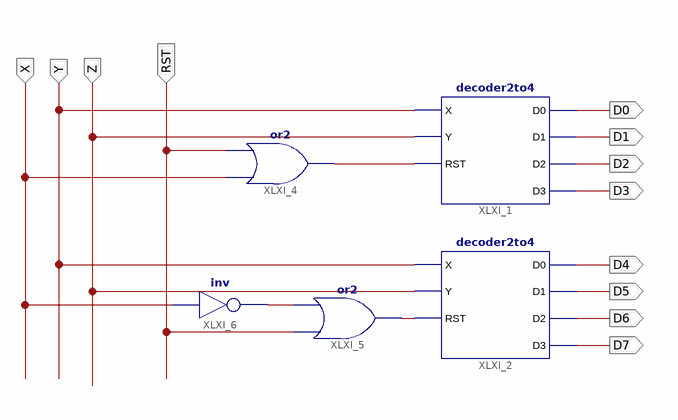
[diagram p0: schematic sheet 1]
// Xilinx ISE schematic decoder3to8.sch (artix7) as structural Verilog: 5 symbols, 12 ports
module decoder3to8 (
  input  Y,
  input  Z,
  input  X,
  input  RST,
  output D0,
  output D1,
  output D2,
  output D3,
  output D4,
  output D5,
  output D6,
  output D7
);

  wire XLXN_13, XLXN_14, XLXN_15;

  decoder2to4 XLXI_1 (.D0(D0), .D1(D1), .D2(D2), .D3(D3), .RST(XLXN_13), .X(Y), .Y(Z));
  decoder2to4 XLXI_2 (.D0(D4), .D1(D5), .D2(D6), .D3(D7), .RST(XLXN_15), .X(Y), .Y(Z));
  or XLXI_4 (XLXN_13, X, RST);
  or XLXI_5 (XLXN_15, RST, XLXN_14);
  not XLXI_6 (XLXN_14, X);
endmodule
